# EAGLE design coqui-v1.0 (EAGLE 7.1.0)
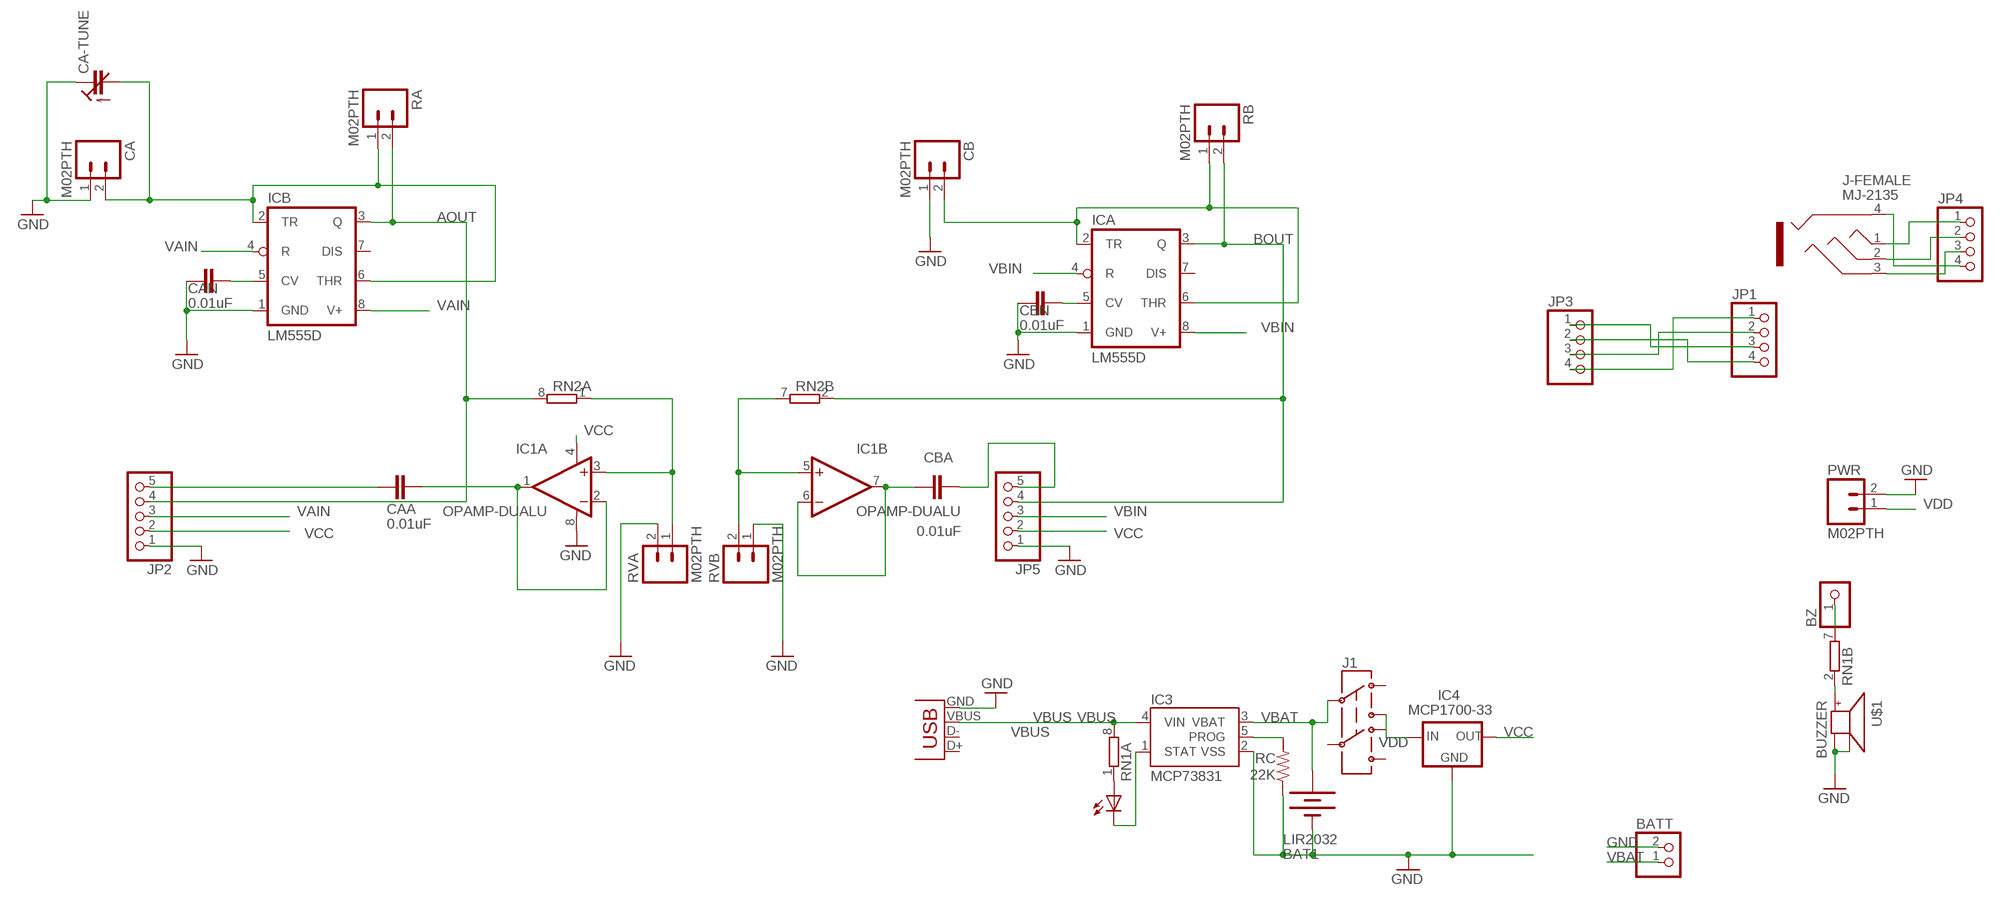
[diagram p0: schematic, sheet 1]

## Parts
BAT1  LIR2032  BATTERYBATTCOM_20MM_PTH_SMT  [BATTCOM_20MM_PTH_SMT]
BATT  JST_2PIN-SMT-RA  [JST-PH-2-SMT-RA]
BZ  PINHD-1X1  [1X01]
CA  M02PTH  [1X02]
CA-TUNE  C-TRIMMTZBX4  [CTRIMTZBX4]
CAA  0.01uF  C-EUC0805  [C0805@1]
CAN  0.01uF  C-EUC0805  [C0805@1]
CB  M02PTH  [1X02]
CBA  0.01uF  C-EUC0805  [C0805@1]
CBN  0.01uF  C-EUC0805  [C0805@1]
CHG  0805  LEDCHIPLED_0805  [CHIPLED_0805]
IC1  OPAMP-DUALU  [SO08]
IC3  MCP73831  [SOT23-5]
IC4  MCP1700-33  MCP1700SOT89  [SOT89]
ICA  LM555D  [SO08]
ICB  LM555D  [SO08]
J1  AYZ0202  [AYZ0202]
J-FEMALE  MJ-2135  [MJ-2135]
JP1  PINHD-1X4/90  [1X04/90]
JP2  PINHD-1X5  [1X05]
JP3  PINHD-1X4  [1X04]
JP4  PINHD-1X4  [1X04]
JP5  PINHD-1X5  [1X05]
PWR  M02PTH  [1X02]
RA  M02PTH  [1X02]
RB  M02PTH  [1X02]
RC  22K  R-US_R0805  [R0805]
RN1  4R-NEXB38V  [EXB38V]
RN2  4R-NEXB38V  [EXB38V]
RVA  M02PTH  [1X02]
RVB  M02PTH  [1X02]
U$1  BUZZER  [SMT-8585-BUZZER]
X1  USBSMD  [USB-MINIB]

## Nets
AOUT: ICB.3(Q) JP2.4 RA.2 RN2.8
BOUT: ICA.3(Q) JP5.4 RB.2 RN2.2
GND: BAT1.P$1(-) BATT.2 CA-TUNE.1(E) CA.1 CAN.1 CB.1 CBN.1 IC1.8(A:V+) IC3.2(VSS) IC4.1(GND) ICA.1(GND) ICB.1(GND) JP2.1 JP5.1 PWR.2 RC.1 RVA.2 RVB.1 U$1.- U$1.A- X1.GND
N$1: J-FEMALE.1 JP4.1
N$2: J-FEMALE.2 JP4.2
N$3: IC3.5(PROG) RC.2
N$4: J-FEMALE.3 JP4.3
N$5: CHG.C IC3.1(STAT)
N$6: J-FEMALE.4 JP4.4
N$7: BZ.1 RN1.7
N$8: CHG.A RN1.1
N$9: CAA.1 JP2.5
N$10: CAA.2 IC1.1(A:OUT) IC1.2(A:-IN)
N$11: CA-TUNE.2(A) CA.2 ICB.2(TR) ICB.6(THR) RA.1
N$12: RN1.2 U$1.+
N$13: CBA.2 JP5.5
N$14: CAN.2 ICB.5(CV)
N$15: CBN.2 ICA.5(CV)
N$16: CB.2 ICA.2(TR) ICA.6(THR) RB.1
N$18: JP1.1 JP3.4
N$19: JP1.3 JP3.1
N$20: JP1.2 JP3.3
N$21: JP1.4 JP3.2
N$23: IC1.3(A:+IN) IC1.5(B:+IN) RN2.1 RN2.7 RVA.1 RVB.2
N$24: CBA.1 IC1.6(B:-IN) IC1.7(B:OUT)
VAIN: ICB.4(R) ICB.8(V+) JP2.3
VBAT [power]: BAT1.P$2(+) BATT.1 IC3.3(VBAT) J1.2
VBIN: ICA.4(R) ICA.8(V+) JP5.3
VBUS [power]: IC3.4(VIN) RN1.8 X1.VBUS
VCC: IC1.4(A:V-) IC4.3(OUT) JP2.2 JP5.2
VDD: IC4.2(IN) J1.1 PWR.1
Unconnected: ICA.7(DIS) ICB.7(DIS) J1.3 J1.4 J1.5 J1.6 RN1.3 RN1.4 RN1.5 RN1.6 RN2.3 RN2.4 RN2.5 RN2.6 X1.D+ X1.D-

## Library data of the parts
BAT1 = SparkFunNew:BATTERY: Battery Holders Various common sizes : AA, AAA, 20mm coin cell and 12mm coin cell.
BATT = adafruit:JST_2PIN: JST 2-Pin Connectors of various flavors SMT-RA (S2B-PH-SM4) 4UConnector #17311 SMT (B2B-PH-SM4) THM-RA (S2B-PH) THM (B2B-PH)
BZ = pinhead:PINHD-1X1: PIN HEADER
CA CB PWR RA RB RVA RVB = SparkFun-Connectors:M02: Standard 2-pin 0.1" header. Use with - straight break away headers ( PRT-00116) - right angle break away headers (PRT-00553) - swiss pins (PRT-00743) - machine pins (PRT-00117) - female headers (PRT-00115) Molex polarized connector foot print use with: PRT-08233 with associated crimp pins and housings. 2.54_SCREWTERM for use with PRT-10571. 3.5mm Screw Terminal footprints for PRT-08084 5mm Screw Terminal footprints for use with PRT-08432
CA-TUNE = rcl:C-TRIMM: Trimm capacitor
CAA CAN CBA CBN = rcl:C-EU: CAPACITOR, European symbol
CHG = led:LED: LED OSRAM: - CHIPLED LG R971, LG N971, LY N971, LG Q971, LY Q971, LO R971, LY R971 LH N974, LH R974 LS Q976, LO Q976, LY Q976 LO Q996 - Hyper CHIPLED LW Q18S LB Q993, LB Q99A, LB R99A - SideLED LS A670, LO A670, LY A670, LG A670, LP A670 LB A673, LV A673, LT A673, LW A673 LH A674 LY A675 LS A676, LA A676, LO A676, LY A676, LW A676 LS A679, LY A679, LG A679 - Hyper Micro SIDELED® LS Y876, LA Y876, LO Y876, LY Y876 LT Y87S - SmartLED LW L88C, LW L88S LB L89C, LB L89S, LG L890 LS L89K, LO L89K, LY L89K LS L896, LA L896, LO L896, LY L896 - TOPLED LS T670, LO T670, LY T670, LG T670, LP T670 LSG T670, LSP T670, LSY T670, LOP T670, LYG T670 LG T671, LOG T671, LSG T671 LB T673, LV T673, LT T673, LW T673 LH T674 LS T676, LA T676, LO T676, LY T676, LB T676, LH T676, LSB T676, LW T676 LB T67C, LV T67C, LT T67C, LS T67K, LO T67K, LY T67K, LW E67C LS E67B, LA E67B, LO E67B, LY E67B, LB E67C, LV E67C, LT E67C LW T67C LS T679, LY T679, LG T679 LS T770, LO T770, LY T770, LG T770, LP T770 LB T773, LV T773, LT T773, LW T773 LH T774 LS E675, LA E675, LY E675, LS T675 LS T776, LA T776, LO T776, LY T776, LB T776 LHGB T686 LT T68C, LB T68C - Hyper Mini TOPLED® LB M676 - Mini TOPLED Santana® LG M470 LS M47K, LO M47K, LY M47K Source: http://www.osram.convergy.de LUXEON: - LUMILED® LXK2-PW12-R00, LXK2-PW12-S00, LXK2-PW14-U00, LXK2-PW14-V00 LXK2-PM12-R00, LXK2-PM12-S00, LXK2-PM14-U00 LXK2-PE12-Q00, LXK2-PE12-R00, LXK2-PE12-S00, LXK2-PE14-T00, LXK2-PE14-U00 LXK2-PB12-K00, LXK2-PB12-L00, LXK2-PB12-M00, LXK2-PB14-N00, LXK2-PB14-P00, LXK2-PB14-Q00 LXK2-PR12-L00, LXK2-PR12-M00, LXK2-PR14-Q00, LXK2-PR14-R00 LXK2-PD12-Q00, LXK2-PD12-R00, LXK2-PD12-S00 LXK2-PH12-R00, LXK2-PH12-S00 LXK2-PL12-P00, LXK2-PL12-Q00, LXK2-PL12-R00 Source: www.luxeon.com KINGBRIGHT: KA-3528ASYC Source: www.kingbright.com
IC1 = SparkFun-AnalogIC:OPAMP-DUAL: Generic op-amp footprint
IC3 = SparkFunNew:MCP73831: Microchip's MCP73831 Miniature single cell, fully integrated Li-Ion, Li-polymer charge management controller http://ww1.microchip.com/downloads/en/DeviceDoc/21984a.pdf
IC4 = adafruit:MCP1700: VOLTAGE REGULATOR
ICA ICB = adafruit:*555: TIMER Changed DIP package to have round (not oval) pin pads http://www.ladyada.net/library/pcb/eaglelibrary.html
J1 = SparkFunNew:AYZ0202: SPDT Slide Switch Simple SMD single-pull double-throw slide switch. Good for less than 350mA power switch, switching UARTs between devices, etc. Spark Fun Electronics SKU : COM-00597
J-FEMALE = iPhoneSoftModem:MJ-2135
JP1 = trrs-dwb:PINHD-1X4: PIN HEADER
JP2 JP5 = pinhead:PINHD-1X5: PIN HEADER
JP3 JP4 = pinhead:PINHD-1X4: PIN HEADER
RC = adafruit2013:R-US_: RESISTOR, American symbol
RN1 RN2 = resistor-dil:4R-N: Array Chip Resistor Source: RS Component / Phycomp; OC_FARNELL: unknown; OC_NEWARK: unknown
U$1 = adafruit:BUZZER
X1 = SparkFun:USB: USB Connectors USB-B-PTH is fully proven SKU : PRT-00139 USB-miniB is fully proven SKU : PRT-00587 USB-A-PCB is untested. USB-A-H is throughly reviewed, but untested. Spark Fun Electronics SKU : PRT-00437 USB-B-SMT is throughly reviewed, but untested. Needs silkscreen touching up. USB-A-S has not been used/tested USB-MB-H has not been used/tested

## Net classes
0 default: width 0.254 mm, clearance 0.203 mm
1 power: width 0.254 mm, clearance 0.178 mm

## Board
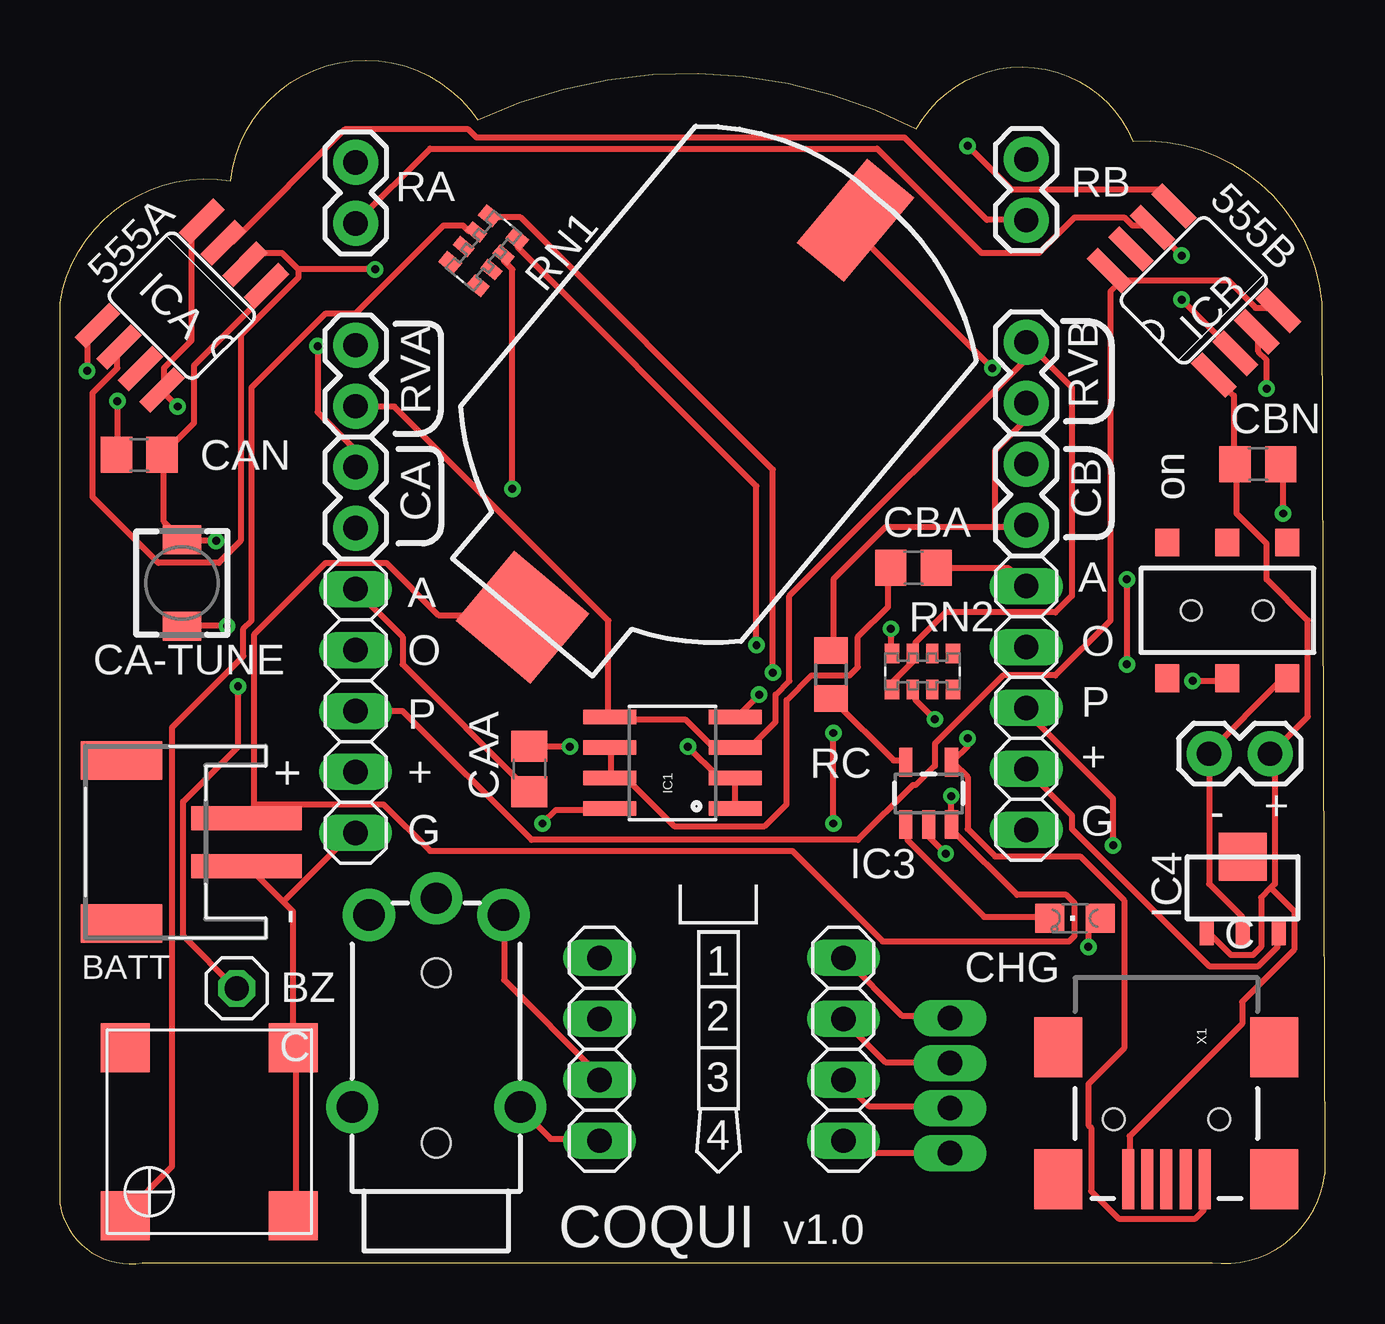
[diagram p1: board, top side]
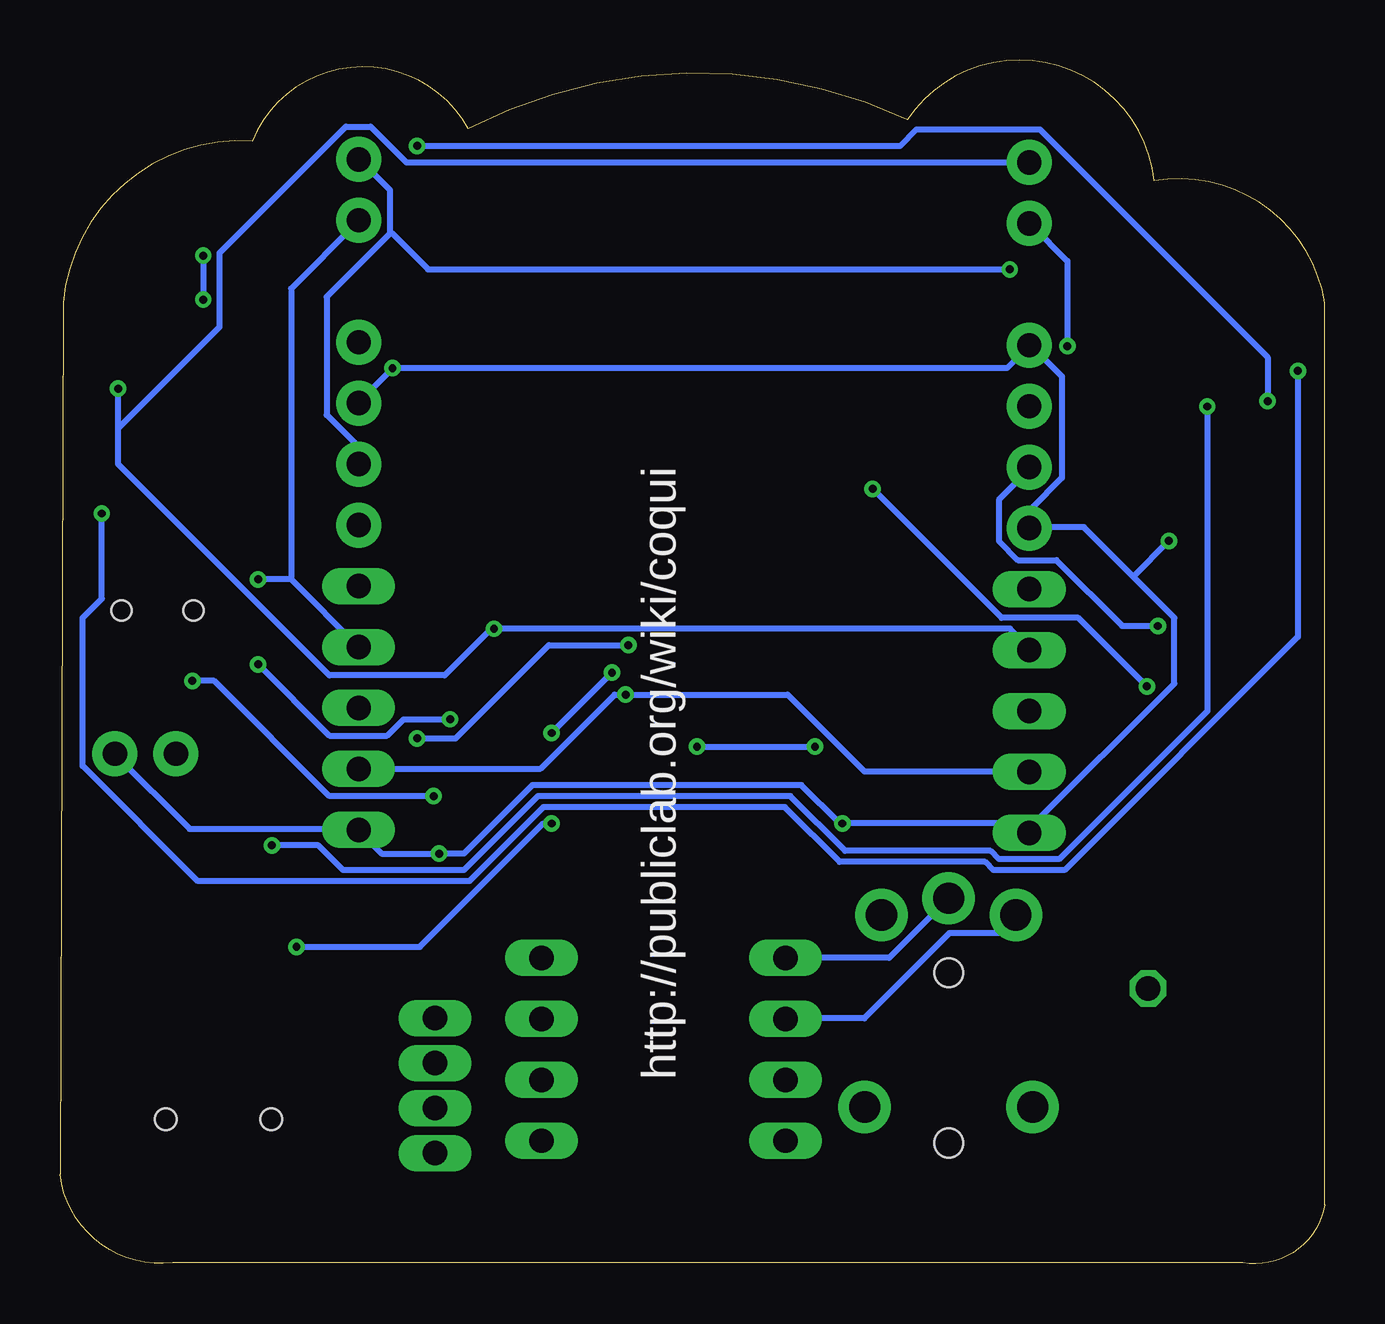
[diagram p2: board, bottom side, seen from below]

Size 52.7 x 50.16 mm. Coordinates in mm from the lower left corner, seen from the top.
Outline: 7.11,45.13 arc-140 17.4,47.67 arc-52 35.69,47.29 arc-128 44.7,46.78 arc-88 52.58,40.05 52.7,3.73 arc-90 48.01,0.04 3.43,0.04 arc-90 0,2.46 0,40.05 arc-90 7.11,45.13
Copper layers (1*16): Top 0.0356mm / dielectric 1.5011mm / Bottom 0.0356mm
Design rules "oshpark-2layer": minimum track width 6mil, minimum drill 13mil, track to track 6mil, track to pad 6mil, pad to pad 6mil, via to via 6mil, smd to smd 6mil, copper to edge 15mil, drill to drill 6mil, minimum pad ring 7mil, minimum via ring 7mil, stop-mask expansion 4mil, vias tented up to drill 0mil, thermal gap 10mil

### Footprints (pad centres in the part's own frame; a part is rotated, then mirrored left to right if it is on the bottom)
BATTCOM_20MM_PTH_SMT = smd 4.572 x 2.54: P$1 0,0 | smd 3.81 x 4.064: P$2 21.59,0
JST-PH-2-SMT-RA = smd 1 x 4.6: 1 1,-3.7; 2 -1,-3.7 | smd 1.6 x 3.4: NC1 -3.4,1.5; NC2 3.4,1.5
1X01 = drill 1.016 octagon: 1 0,0
1X02 = drill 1.016 pad 1.88: 1 0,0; 2 2.54,0
CTRIMTZBX4 = smd 1.6 x 1.2: 1 0,1.8; 2 0,-1.8
C0805@1 = smd 1.3 x 1.5: 1 -0.95,0; 2 0.95,0
CHIPLED_0805 = smd 1.2 x 1.2: A 0,-1.05; C 0,1.05
SO08 = smd 0.61 x 2.21: 1 -1.905,-2.616; 2 -0.635,-2.616; 3 0.635,-2.616; 4 1.905,-2.616; 5 1.905,2.616; 6 0.635,2.616; 7 -0.635,2.616; 8 -1.905,2.616
SOT23-5 = smd 0.55 x 1.2: 1 -0.95,-1.3; 2 0,-1.3; 3 0.95,-1.3; 4 0.95,1.3; 5 -0.95,1.3
SOT89 = smd 0.58 x 1.2: 1 -1.5,-1.8; 2 0,-1.8; 3 1.5,-1.8 | smd 2 x 2: 4 0,1.3
SO08' = smd 0.66 x 2.032: 1 -1.905,-3.073; 2 -0.635,-3.073; 3 0.635,-3.073; 4 1.905,-3.073; 5 1.905,3.073; 6 0.635,3.073; 7 -0.635,3.073; 8 -1.905,3.073
AYZ0202 = smd 1 x 1.15: 1 -2.5,2.825; 2 0,2.825; 3 2.5,2.825; 4 -2.5,-2.825; 5 0,-2.825; 6 2.5,-2.825 | hole 0.85: 1.5,0; -1.5,0
MJ-2135 = drill 1.3 pad 2.184: 1 0,8.5; 1@2 7,8.5; 2 0.7,0.5; 3 6.3,0.5; 4 3.5,-0.2 | hole 1.2: 3.5,2.9; 3.5,10
1X04/90 = drill 1.016 long: 1 2.928,-2.286; 2 1.053,-2.286; 3 -2.697,-2.286; 4 -0.822,-2.286
1X05 = drill 1.016 long: 1 -5.08,0; 2 -2.54,0; 3 0,0; 4 2.54,0; 5 5.08,0
1X04 = drill 1.016 long: 1 -3.81,0; 2 -1.27,0; 3 1.27,0; 4 3.81,0
R0805 = smd 1.1 x 1.4: 1 -1,0; 2 1,0
EXB38V = smd 0.6 x 0.8: 1 -1.275,-0.75; 4 1.275,-0.75; 5 1.275,0.75; 8 -1.275,0.75 | smd 0.5 x 0.8: 2 -0.4,-0.75; 3 0.4,-0.75; 6 0.4,0.75; 7 -0.4,0.75
SMT-8585-BUZZER = smd 2.05 x 2.05: + -3.5,-3.5; - 3.5,-3.5; A- 3.5,3.5; NC1 -3.5,3.5
USB-MINIB = smd 2.5 x 0.5: D+ 2.5,0; D- 2.5,0.8; GND 2.5,-1.6; ID 2.5,-0.8; VBUS 2.5,1.6 | smd 2.5 x 2: GND@1 -3,-4.5; GND@2 -3,4.5; GND@3 2.5,4.5; GND@4 2.5,-4.5 | hole 0.9: 0,2.2; 0,-2.2

### Placement (x,y rotation side)
BAT1  33.15,43.48 230 top
BATT  4.06,17.57 90 top
BZ  7.37,11.47 180 top
CA  12.32,30.65 90 top
CA-TUNE  5.08,28.36 0 top
CAA  19.56,20.62 90 top
CAN  3.3,33.7 180 top
CB  40.26,30.78 90 top
CBA  35.56,29 0 top
CBN  49.91,33.32 0 top
CHG  42.29,14.39 90 top
IC1  25.53,20.87 90 top
IC3  36.2,19.6 0 top
IC4  49.28,15.66 0 top
ICA  LM555D  [SO08']  5.08,39.92 135 top
ICB  LM555D  [SO08']  47.24,40.56 45 top
J1  48.64,27.22 180 top
J-FEMALE  19.18,15.03 180 top
JP1  39.37,7.54 270 top
JP2  12.32,23.03 90 top
JP3  32.64,8.93 270 top
JP4  22.48,8.93 90 top
JP5  40.26,23.16 90 top
PWR  47.88,21.25 0 top
RA  12.32,43.35 90 top
RB  40.26,46.02 270 top
RC  32.13,24.55 270 top
RN1  17.65,42.21 230 top
RN2  35.94,24.68 0 top
RVA  12.32,35.73 90 top
RVB  40.26,35.86 90 top
U$1  6.22,5.5 0 top
X1  46.1,6.01 270 top

### Tracks (layer width: path | path; a pad name or v marks a point on that pad's centre or on a via)
AOUT  (via drill 0.33)
  Top 0.254: v34.62,26.46 34.62,25.55 RN2.8 | v50.28,36.47 50.28,37.66 49.94,38 49.94,38.8 ICB.3
  Bottom 0.254: JP2.4 12.33,25.66 13.13,26.46 v34.62,26.46 34.73,26.46 36.68,24.52 41.48,24.52 50.28,33.32 v50.28,36.47 50.28,34.8 46.05,39.03 46.05,42.12 40.79,47.38 39.76,47.38 38.28,45.89 RA.2
BOUT  (via drill 0.33)
  Top 0.254: v36.45,22.69 35.65,23.49 35.65,23.83 RN2.2 | v44.45,28.52 v44.45,24.97 | ICA.3 6.84,42.58 7.19,42.58 11.87,47.26 17.02,47.26 17.36,46.92 35.19,46.92 38.62,43.49 40.22,43.49 RB.2
  Bottom 0.254: v36.45,22.69 38.39,22.69 39.08,22 41.48,22 v44.45,24.97 | 43.08,28.52 v44.45,28.52 | JP5.4 43.08,28.52 | 43.08,28.52 43.08,40.63 40.34,43.38 RB.2
GND  (via drill 0.33)
  Top 0.254: v36.91,17.09 36.22,17.77 36.22,18.23 IC3.2 | ICB.1 48.11,36.98 48.91,36.18 48.91,33.32 CBN.1 49.02,33.2 49.02,31.26 50.28,30 50.28,28.52 51.99,26.8 51.99,22.8 50.51,21.32 PWR.2 50.51,21.2 50.62,21.09 50.62,15.83 50.45,15.66 | 50.45,15.66 50.05,15.26 50.05,13.2 49.71,12.86 48.79,12.86 47.88,13.77 IC4.1 | 50.45,15.66 51.42,14.69 51.42,13.09 49.25,10.91 49.25,10 44.56,5.31 44.56,3.6 X1.GND | 38.96,30.69 40.22,30.69 CB.1 | 38.96,30.69 34.39,30.69 32.22,28.52 32.22,25.66 RC.1 | 38.96,30.69 38.96,33.89 40.22,35.15 40.22,35.83 RVB.1 | v38.85,37.32 33.25,42.92 33.25,43.38 BAT1.P$1 | U$1.- 9.82,2.11 9.82,8.97 U$1.A- 9.7,9.09 9.7,14.69 9.3,15.09 | 9.3,15.09 7.87,16.52 BATT.2 | ICA.1 8.56,40.75 8.56,40.4 5.59,37.43 5.59,35.03 4.33,33.77 CAN.1 4.33,33.66 4.33,30.92 5.02,30.23 CA-TUNE.1 5.13,30.12 v6.5,30.12 | v20.1,18.34 20.68,18.92 22.85,18.92 IC1.8 | 9.3,15.09 12.22,18 JP2.1
  Bottom 0.254: PWR.2 50.39,21.2 47.31,18.12 40.34,18.12 JP5.1 40.22,18 39.31,17.09 v36.91,17.09 35.88,17.09 33.02,19.94 21.82,19.94 20.22,18.34 v20.1,18.34 12.68,18.34 12.33,18 JP2.1 12.33,18.12 6.27,24.17 6.27,26.92 7.99,28.63 | RVB.1 40.22,35.95 v38.85,37.32 13.25,37.32 12.33,38.23 RVA.2 12.22,38.23 10.96,36.98 10.96,32.75 12.22,31.49 12.22,30.69 CA.1 12.1,30.69 10.05,30.69 7.99,28.63 | 7.99,28.63 v6.5,30.12
N$1
  Top 0.254: JP4.1 22.39,5.2 20.45,5.2 19.19,6.46 J-FEMALE.1
N$2
  Top 0.254: JP4.2 22.39,7.71 22.39,7.94 18.5,11.83 18.5,14.46 J-FEMALE.2
N$3
  Top 0.254: IC3.5 35.19,20.97 34.73,20.97 32.22,23.49 RC.2
N$4
  Bottom 0.254: JP4.3 22.39,10.23 19.19,10.23 15.65,13.77 13.59,13.77 12.9,14.46 J-FEMALE.3
N$5
  Top 0.254: CHG.C 41.13,14.46 38.51,14.46 35.31,17.66 35.31,18.23 IC3.1
N$6
  Bottom 0.254: JP4.4 18.16,12.74 15.76,15.14 J-FEMALE.4
N$7  (via drill 0.33)
  Top 0.254: v18.85,32.29 18.85,41.43 18.5,41.78 18.5,42 RN1.7 | v7.42,24.06 7.42,21.54 5.13,19.26 5.13,13.66 7.3,11.49 BZ.1
  Bottom 0.254: v18.85,32.29 13.47,26.92 10.27,26.92 v7.42,24.06
N$8  (via drill 0.33)
  Top 0.254: v29.7,24.63 29.7,33.09 19.19,43.6 17.93,43.6 RN1.1 | v32.22,18.34 v32.22,22.12 | v42.85,13.2 42.85,13.89 43.31,14.34 CHG.A
  Bottom 0.254: v32.22,22.12 v29.7,24.63 | v32.22,18.34 32.56,18.34 37.71,13.2 v42.85,13.2
N$9
  Top 0.254: CAA.1 19.53,19.72 14.28,24.97 14.28,26.12 12.33,28.06 JP2.5
N$10  (via drill 0.33)
  Top 0.254: v21.25,21.54 19.65,21.54 CAA.2 | v26.16,21.54 27.42,20.29 28.1,20.29 IC1.2 28.1,20.17 28.1,19.03 IC1.1
  Bottom 0.254: v26.16,21.54 v21.25,21.54
N$11  (via drill 0.33)
  Top 0.254: v6.96,26.57 5.13,26.57 CA-TUNE.2 | RA.1 12.33,43.38 15.42,46.46 34.05,46.46 38.39,42.12 40.79,42.12 42.28,43.6 44.34,43.6 44.68,43.26 45.48,43.26 ICB.6 45.59,43.15 v46.74,42 | v46.74,40.18 48.91,38 ICB.2 | v10.73,38.23 10.73,35.49 12.22,34 12.22,33.2 CA.2
  Bottom 0.254: v6.96,26.57 8.45,26.57 11.19,29.32 12.79,29.32 13.59,30.12 13.59,31.83 12.33,33.09 CA.2 | v46.74,42 v46.74,40.18 | v10.73,38.23 10.73,41.78 12.22,43.26 RA.1
N$12
  Top 0.254: RN1.2 17.25,43.03 17.02,43.03 16.79,43.26 15.99,43.26 12.33,39.6 11.07,39.6 7.99,36.52 7.99,26.8 7.64,26.46 7.64,25.32 4.67,22.34 4.67,4.06 2.73,2.11 U$1.+
N$13
  Top 0.254: CBA.2 36.56,28.97 39.53,28.97 40.22,28.29 JP5.5
N$14  (via drill 0.33)
  Top 0.254: v2.39,35.95 2.39,33.77 CAN.2 | v37.82,46.58 39.65,44.75 45.82,44.75 46.39,44.18 ICB.5
  Bottom 0.254: v2.39,35.95 2.39,37.78 11.87,47.26 17.02,47.26 17.7,46.58 v37.82,46.58
N$15  (via drill 0.33)
  Top 0.254: v50.96,31.26 50.96,33.32 CBN.2 | v1.13,37.2 1.13,38.69 1.47,39.03 ICA.5
  Bottom 0.254: v50.96,31.26 50.96,27.72 51.77,26.92 51.77,20.74 46.96,15.94 35.65,15.94 32.56,19.03 22.5,19.03 20.22,16.74 14.16,16.74 13.82,16.4 10.85,16.4 1.13,26.12 v1.13,37.2
N$16  (via drill 0.33)
  Top 0.254: 9.93,41.43 9.93,41.09 7.53,38.69 7.53,30.12 6.62,29.2 4.1,29.2 1.36,31.95 1.36,36.29 2.39,37.32 2.39,38.12 ICA.6 | 9.93,41.43 9.25,42.12 8.22,42.12 7.76,41.66 ICA.2 | v13.13,41.43 9.93,41.43
  Bottom 0.254: 38.96,42.92 41.59,40.29 41.59,35.37 40.34,34.12 40.34,33.32 CB.2 | 38.96,42.92 38.96,44.75 40.22,46 RB.1 | v13.13,41.43 37.36,41.43 38.85,42.92 38.96,42.92
N$18
  Top 0.254: JP3.4 33.13,4.63 37.02,4.63 JP1.1
N$19
  Top 0.254: JP1.3 37.02,10.34 35.08,10.34 32.68,12.74 JP3.1
N$20
  Top 0.254: JP1.2 37.02,6.57 33.71,6.57 32.68,7.6 JP3.3
N$21
  Top 0.254: JP1.4 37.02,8.4 34.39,8.4 32.68,10.11 JP3.2
N$23
  Top 0.254: RN2.1 34.73,23.94 34.73,24.29 35.53,25.09 RN2.7 35.65,25.55 35.65,25.89 36.91,27.15 41.48,27.15 42.16,27.83 42.16,36.52 40.34,38.35 RVB.2 40.56,38 30.39,27.83 30.39,24.29 29.82,23.72 29.82,22.57 28.79,21.54 28.22,21.54 IC1.3 28.1,21.54 27.19,21.54 26.05,22.69 22.96,22.69 IC1.5 22.85,22.8 22.85,26.8 13.93,35.72 12.33,35.72 RVA.1
N$24
  Top 0.254: CBA.1 34.51,28.97 34.51,27.37 33.25,26.12 33.25,24.86 32.91,24.52 31.31,24.52 30.28,23.49 30.28,19.14 29.36,18.23 25.59,18.23 23.65,20.17 22.96,20.17 IC1.7 22.96,20.29 22.96,21.43 IC1.6
VAIN
  Top 0.254: ICB.4 50.74,39.83 49.82,39.83 48.68,40.98 44.11,40.98 43.76,41.32 ICB.8 44.11,40.86 43.76,40.52 43.76,26.8 41.48,24.52 39.31,24.52 36.45,21.66 36.45,20.74 35.65,19.94 35.53,19.94 33.25,17.66 19.65,17.66 14.28,23.03 JP2.3
VBAT  (via drill 0.33)
  Top 0.254: v47.19,24.29 48.56,24.29 J1.2 | v37.13,19.49 37.13,18.34 IC3.3 37.25,18.23 37.25,18 39.88,15.37 41.93,15.37 42.28,15.03 42.28,13.66 42.05,13.43 34.28,13.43 30.51,17.2 15.42,17.2 13.47,19.14 8.1,19.14 | 8.1,19.14 8.1,18.8 7.87,18.57 BATT.1 | 8.1,19.14 8.1,26.23 11.07,29.2 13.59,29.2 15.76,27.03 19.19,27.03 BAT1.P$2
  Bottom 0.254: v47.19,24.29 46.28,24.29 41.48,19.49 v37.13,19.49
VBIN  (via drill 0.33)
  Top 0.254: ICA.4 5.82,43.38 5.47,43.03 5.47,38.46 4.33,37.32 4.33,36.4 ICA.8 4.33,36.29 v4.9,35.72 | v43.88,17.43 43.88,19.37 40.34,22.92 40.34,23.14 JP5.3
  Bottom 0.254: v43.88,17.43 41.93,17.43 40.91,16.4 35.88,16.4 32.79,19.49 22.28,19.49 19.99,17.2 13.93,17.2 13.59,16.86 11.07,16.86 4.9,23.03 v4.9,35.72
VBUS  (via drill 0.33)
  Top 0.254: v29.02,25.77 29.02,32.4 19.08,42.35 19.08,42.69 RN1.8 | v37.82,21.89 37.82,21.54 37.25,20.97 IC3.4 37.25,20.86 37.82,20.29 37.82,18.12 38.96,16.97 42.51,16.97 44.34,15.14 44.34,8.97 42.85,7.49 42.85,5.77 42.96,5.66 42.96,3.03 44.11,1.88 47.31,1.88 47.65,2.23 47.65,3.49 X1.VBUS
  Bottom 0.254: v29.02,25.77 32.33,25.77 36.22,21.89 v37.82,21.89
VCC  (via drill 0.33)
  Top 0.254: IC4.3 50.74,13.77 50.74,13.2 49.94,12.4 47.88,12.4 42.16,18.12 42.16,18.69 40.34,20.52 JP5.2 | v29.13,23.72 28.22,22.8 IC1.4
  Bottom 0.254: JP5.2 40.22,20.63 32.68,20.63 29.59,23.72 v29.13,23.72 22.39,23.72 19.19,20.52 12.33,20.52 JP2.2
VDD
  Top 0.254: J1.1 51.08,24.29 50.85,24.29 47.88,21.32 PWR.1 47.88,15.83 49.25,14.46 49.25,13.89 IC4.2

### Text on the board
tPlace: 555B | 555A | on | A | A | O | O | P | P | + | + | - | G | + | G | IC3 | IC4 | C | 1 | 2 | C | 3 | 4 | COQUI | v1.0
bPlace: http://publiclab.org/wiki/coqui